# Altium schematic sheet ArduinoUnoShield.SchDoc
size A4
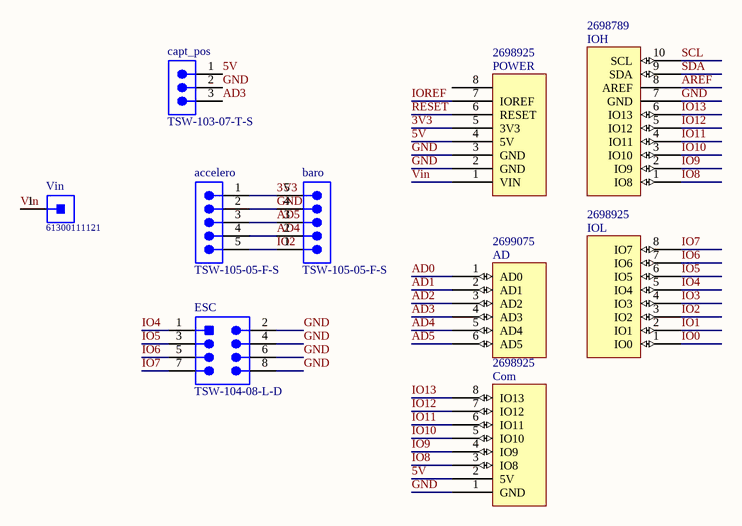
[diagram p0: ArduinoUnoShield.SchDoc]

## Parts
accelero  TSW-105-05-F-S  [SMTC-TSW-105-05-X-S]
AD  Supplier Part Number 4: 2699075  [Header 6x1 8.5mm]  (hidden comment: AD)
baro  TSW-105-05-F-S  [SMTC-TSW-105-05-X-S]
capt_pos  TSW-103-07-T-S  [SMTC-TSW-103-07-X-S]
Com  Supplier Part Number 4: 2698925  [Header 8x1 8.5mm]  (hidden comment: POWER_UNO)
ESC  TSW-104-08-L-D  [SMTC-TSW-104-08-L-D_V]
IOH  Supplier Part Number 3: 2698789  [Header 10x1 8.5mm]  (hidden comment: IOH)
IOL  Supplier Part Number 4: 2698925  [Header 8x1 8.5mm]  (hidden comment: IOL)
POWER  Supplier Part Number 4: 2698925  [Header 8x1 8.5mm]  (hidden comment: POWER_UNO)
Vin  61300111121  [61300111121]

## Nets
3V3: accelero.1 baro.5 POWER.5(3V3)
5V: capt_pos.1 Com.2(5V) POWER.4(5V)
AD0: AD.1(AD0)
AD1: AD.2(AD1)
AD2: AD.3(AD2)
AD3: AD.4(AD3) capt_pos.3
AD4: accelero.4 AD.5(AD4) baro.2
AD5: accelero.3 AD.6(AD5) baro.3
AREF: IOH.8(AREF)
GND: accelero.2 baro.4 capt_pos.2 Com.1(GND) ESC.2 ESC.4 ESC.6 ESC.8 IOH.7(GND) POWER.2(GND) POWER.3(GND)
IO0: IOL.1(IO0)
IO1: IOL.2(IO1)
IO2: accelero.5 baro.1 IOL.3(IO2)
IO3: IOL.4(IO3)
IO4: ESC.1 IOL.5(IO4)
IO5: ESC.3 IOL.6(IO5)
IO6: ESC.5 IOL.7(IO6)
IO7: ESC.7 IOL.8(IO7)
IO8: Com.3(IO8) IOH.1(IO8)
IO9: Com.4(IO9) IOH.2(IO9)
IO10: Com.5(IO10) IOH.3(IO10)
IO11: Com.6(IO11) IOH.4(IO11)
IO12: Com.7(IO12) IOH.5(IO12)
IO13: Com.8(IO13) IOH.6(IO13)
IOREF: POWER.7(IOREF)
RESET: POWER.6(RESET)
SCL: IOH.10(SCL)
SDA: IOH.9(SDA)
Vin: POWER.1(VIN) Vin.1

Not connected (* = marked no-connect by the designer): POWER 8

## Library data of the parts
accelero baro = CMP-1024-00365-1: 0.025" SQ Post Header, Through-hole, Vertical, -55 to 125 degC, 2.54 mm Pitch, 5-Pin, Male, RoHS; Manufacturer: Samtec; Pitch: 2.54 mm; PackageReference: TSW-105-05-X-S; ComponentLink1Description: Manufacturer URL; Temperature Range: -55 to 125 degC; ComponentLink2Description: Datasheet; ComponentLink2URL: http://www.samtec.com/documents/webfiles/pdf/TSW_TH.PDF; PartNumber: TSW-105-05-F-S; ComponentLink3URL: http://www.samtec.com/documents/webfiles/cpdf/TSW-XXX-XX-XXX-X-XX-XXX-MKT.pdf; ComponentLink1URL: http://www.samtec.com; DatasheetVersion: F-214; Mounting Technology: Through-hole; RoHS: True; PackageVersion: DM, 8/1988; ComponentLink3Description: Package Specification; PackageDescription: .025[0.64] SQ. Post Terminal Strip Assembly; Orientation: Vertical
capt_pos = CMP-1024-00332-1: 0.025" SQ Post Header, Through-hole, Vertical, -55 to 105 degC, 2.54 mm Pitch, 3-Pin, Male, RoHS; Manufacturer: Samtec; Pitch: 2.54 mm; ComponentLink1URL: http://www.samtec.com; ComponentLink3URL: http://www.samtec.com/documents/webfiles/cpdf/TSW-XXX-XX-XXX-X-XX-XXX-MKT.pdf; PartNumber: TSW-103-07-T-S; Mounting Technology: Through-hole; RoHS: True; DatasheetVersion: F-214; PackageVersion: DM, 8/1988; Temperature Range: -55 to 105 degC; ComponentLink2Description: Datasheet; ComponentLink1Description: Manufacturer URL; Orientation: Vertical; PackageReference: TSW-103-07-X-S; ComponentLink3Description: Package Specification; ComponentLink2URL: http://www.samtec.com/documents/webfiles/pdf/TSW_TH.PDF; PackageDescription: .025[0.64] SQ. Post Terminal Strip Assembly
ESC = CMP-1681-00006-4: Male Header, Pitch 2.54 mm, 2 x 4 Position, Height 8.38 mm, Tail Length 5.08 mm, -55 to 125 degC, RoHS, Bulk; Manufacturer: Samtec; Voltage Rating: 550 V; Current Rating: 7.6 A; Rows: 2; ComponentLink2URL: https://datasheet.ciiva.com/25616/0900766b81154476-25616879.pdf; Package Quantity: 1; PackageDescription: Male Header, Pitch 2.54 mm, 2 x 4 Position, Height 8.38 mm, Tail Length 5.08 mm; ComponentLink1Description: Manufacturer URL; Lead Pitch: 0.1 inch; REACH SVHC: No SVHC; Mounting Technology: Through Hole; PackageReference: TSW-104-08-L-D; Contact Plating: Gold; DatasheetVersion: 04/2012; Colour: Black; Contact Finish: Gold; ComponentLink3URL: http://suddendocs.samtec.com/prints/tsw-xxx-xx-x-x-xx-xxx-footprint.pdf; ComponentLink3Description: Package Specification; Mount: Through Hole; RoHSCompliant: true; Packaging: Bulk; ComponentLink2Description: Datasheet; Contact Material: Bronze; Pins: 8; ComponentLink1URL: http://www.samtec.com/
Vin = CMP-1502-01058-1: THT Vertical Pin Header WR-PHD, Pitch 2.54 mm, Single Row, 1 pins; Manufacturer: Wurth Elektronik; Gender: Male; Working Voltage: 250VAC; Withstanding Voltage: 500VAC; Pin Number: 1; Contact Resistance: 20mOhm; Rated Current: 3A; Pitch: 2.54mm; Mounting Technology: THT; Datasheet URL: https://katalog.we-online.de/em/datasheet/6130xx11121.pdf; Manufacturer URL: http://www.we-online.de; Operating Temperature: -40to105degC; Publisher: WurthElektronik; Part Number: 61300111121; Row Number: Single; Package Reference: 61300111121; Orientation: Vertical; Packaging: Bag
AD = AD: Supplier 1: Arrow; Supplier Part Number 1: 2699089; Supplier 2: Digi-Key; Supplier Part Number 2: SAM1198-06-ND; Supplier 3: Arrow; Supplier Part Number 3: 2699088; Supplier 4: Arrow
Com POWER = POWER_UNO: Supplier 1: Digi-Key; Supplier Part Number 1: SAM1198-08-ND; Supplier 2: Arrow; Supplier Part Number 2: 2698939; Supplier 3: Arrow; Supplier Part Number 3: 2698940; Supplier 4: Arrow
IOH = IOH: Supplier 1: Arrow; Supplier Part Number 1: 2698803S4475693N1004; Supplier 2: Digi-Key; Supplier Part Number 2: SAM1198-10-ND; Supplier 3: Arrow
IOL = IOL: Supplier 1: Digi-Key; Supplier Part Number 1: SAM1198-08-ND; Supplier 2: Arrow; Supplier Part Number 2: 2698939; Supplier 3: Arrow; Supplier Part Number 3: 2698940; Supplier 4: Arrow